# Altium schematic sheet sensor.SchDoc
size A4; DrawnBy: Van Tuan Ngo; Organization: PIF Club; Address1: 304B1, HCMUT,; Address2: Ly Thuong Kiet St.,; Address3: District 10, HCM, VN; DocumentNumber: 4; Revision: 1.0.0; SheetNumber: 4; SheetTotal: 8; Project: PIFWRobot
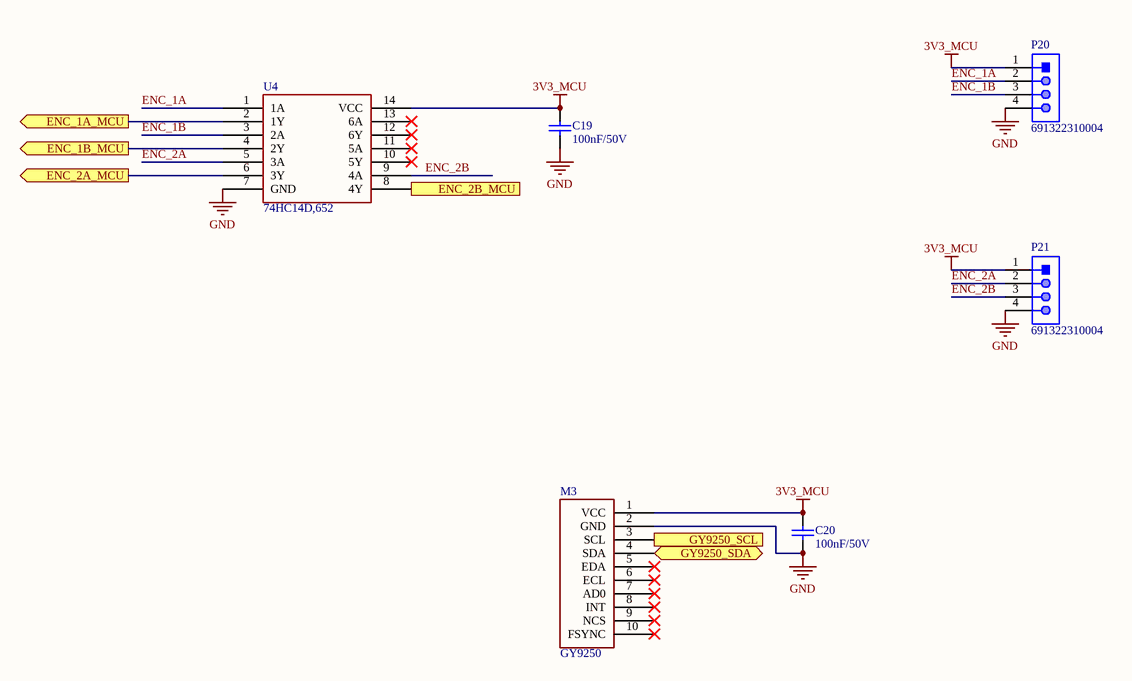
[diagram p0: sensor.SchDoc]

## Parts
C19  value 100nF/50V  [CAP-SM-0805]  (hidden comment: Cap-100nF-50V-0805)
C20  value 100nF/50V  [CAP-SM-0805]  (hidden comment: Cap-100nF-50V-0805)
M3  GY9250  [GY9250]
P20  691322310004  [691322310004]
P21  691322310004  [691322310004]
U4  74HC14D,652  [SOT108-1_NEX]

## Ports
ENC_1A_MCU (out), ENC_1B_MCU (out), ENC_2A_MCU (out), ENC_2B_MCU (out), GY9250_SCL (in), GY9250_SDA (bidir)

## Nets
3V3_MCU: C19.2 C20.2 M3.1(VCC) P20.1 P21.1 U4.14(VCC)
GND: C19.1 C20.1 M3.2(GND) P20.4 P21.4 U4.7(GND)
ENC_1A: P20.2 U4.1(1A)
ENC_1A_MCU: U4.2(1Y) ; port ENC_1A_MCU
ENC_1B: P20.3 U4.3(2A)
ENC_1B_MCU: U4.4(2Y) ; port ENC_1B_MCU
ENC_2A: P21.2 U4.5(3A)
ENC_2A_MCU: U4.6(3Y) ; port ENC_2A_MCU
ENC_2B: P21.3 U4.9(4A)
ENC_2B_MCU: U4.8(4Y) ; port ENC_2B_MCU
GY9250_SCL: M3.3(SCL) ; port GY9250_SCL
GY9250_SDA: M3.4(SDA) ; port GY9250_SDA

Not connected (* = marked no-connect by the designer): M3 5(EDA)* 6(ECL)* 7(AD0)* 8(INT)* 9(NCS)* 10(FSYNC)*; U4 10(5Y)* 11(5A)* 12(6Y)* 13(6A)*

## Notes on the sheet
- Project
- Revision
- Date
- Author
- Sheet
- Time
- of
- File

## Library data of the parts
C19 C20 = Cap-100nF-50V-0805: CAP CER 0.1UF 50V Y5V 0805; Manufacturer: Samsung Electro-Mechanics; Manufacturer Part Number: CL21F104ZBCNNNC; Local Supplier: thegioiic; Local Supplier Link: https://thegioiic.com/products/tu-100nf-0-1uf-50v-0805; Supplier 1: Digikey; Supplier 1 Part Number: 1276-1007-1-ND; Supplier 1 Link: https://www.digikey.com/product-detail/en/samsung-electro-mechanics/CL21F104ZBCNNNC/1276-1007-1-ND/3889093
P20 P21 = 691322310004: WR-TBL Serie 322 Horizontal PCB Header, Pluggable, pitch 3.81mm, 4p; Local Suplier Part Number: x; Compliance: RoHS; Modularity: No; Pin Number: 4; Rated Current [UL]: 10A; Working Voltage [UL]: 300VAC; ComponentLink1Description: Manufacturer; ComponentLink1URL: http://www.we-online.de; ComponentLink2URL: https://katalog.we-online.de/em/datasheet/691322310004.pdf; ComponentLink2Description: Datasheet; Mounting Technology: THT; Part Number: 691322310004; Packaging: Box; Operating Temperature: -40 to +105degC; PCB/Cable/Panel: PCB; Pitch: 3.81mm; Published Date: October 2019; Type: Horizontal; Publisher: Wurth Elektronik; Application: Pluggable; Local Supplier: thegioiic; Local Supplier Link: https://www.thegioiic.com/products/ul-3-81-4-r-terminal-block-plug-in-han-pcb-4-chan-cong-3-81mm-ulo
U4 = 74HC14D,652: Vendor: Nexperia; SourceLibrary: Nexperia_2018-05-2018; Manufacturer_Part_Number: 74HC14D,652; Copyright: Copyright (C) 2016 Accelerated Designs. All rights reserved; RefDes: RefDes; Type: DEV; Value: Value; Local Supplier: thegioiic; Local Supplier Part Number: *; Local Supplier Link: https://www.thegioiic.com/products/74hc14d
M3 = GY9250: Local Supplier: thegioiic; Local Supplier Part Number: *; Local Supplier Link: https://www.thegioiic.com/products/gy-9250-mach-cam-bien-9dof